# EAGLE design EV-Board-Camera_V1.0 (EAGLE 9.6.2)
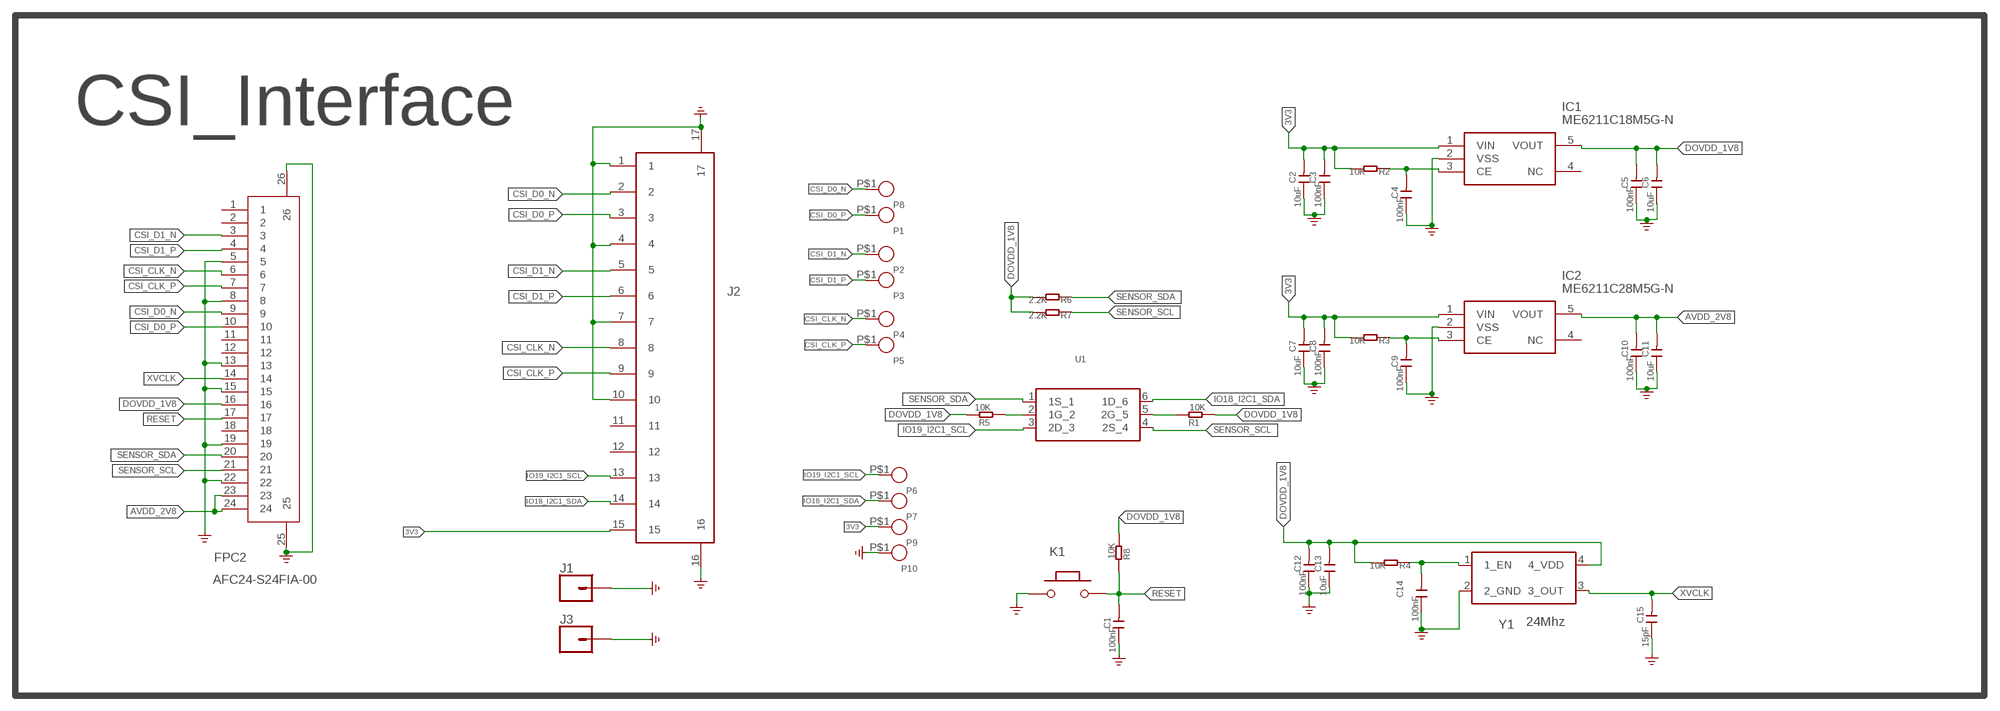
[diagram p0: schematic, sheet 1]

## Parts
C1  100nF  CAPC0402-1  [C0402]
C2  10uF  CAPC0402-1  [C0402]
C3  100nF  CAPC0402-1  [C0402]
C4  100nF  CAPC0402-1  [C0402]
C5  100nF  CAPC0402-1  [C0402]
C6  10uF  CAPC0402-1  [C0402]
C7  10uF  CAPC0402-1  [C0402]
C8  100nF  CAPC0402-1  [C0402]
C9  100nF  CAPC0402-1  [C0402]
C10  100nF  CAPC0402-1  [C0402]
C11  10uF  CAPC0402-1  [C0402]
C12  100nF  CAPC0402-1  [C0402]
C13  10uF  CAPC0402-1  [C0402]
C14  100nF  CAPC0402-1  [C0402]
C15  15pF  CAPC0402-1  [C0402]
FPC2  AFC24-S24FIA-00  [FPC-SMD_P0.50-24P_QCHF-SM-H2.0]
IC1  ME6211C18M5G-N  [SOT95P282X145-5N]
IC2  ME6211C28M5G-N  ME6211C18M5G-N  [SOT95P282X145-5N]
J1  CONN_01_3.1MM_SMD1X01_3.1MM_SMD  [1X01_2MM]
J2  C262349_15P_1MM_下接_AFA07-S15FCC-00  [C262349_15P_1MM_下接_AFA07-S15FCC-00]
J3  CONN_01_3.1MM_SMD1X01_3.1MM_SMD  [1X01_2MM]
K1  BUTTON  PB157  [157SW]
P1  TEST_PADPAD-1.5MM  [TEST_PAD-1.5MM]
P2  TEST_PADPAD-1.5MM  [TEST_PAD-1.5MM]
P3  TEST_PADPAD-1.5MM  [TEST_PAD-1.5MM]
P4  TEST_PADPAD-1.5MM  [TEST_PAD-1.5MM]
P5  TEST_PADPAD-1.5MM  [TEST_PAD-1.5MM]
P6  TEST_PADPAD-1.5MM  [TEST_PAD-1.5MM]
P7  TEST_PADPAD-1.5MM  [TEST_PAD-1.5MM]
P8  TEST_PADPAD-1.5MM  [TEST_PAD-1.5MM]
P9  TEST_PADPAD-1.5MM  [TEST_PAD-1.5MM]
P10  TEST_PADPAD-1.5MM  [TEST_PAD-1.5MM]
R1  10K  RES-0402  [R0402]
R2  10K  RES-0402  [R0402]
R3  10K  RES-0402  [R0402]
R4  10K  RES-0402  [R0402]
R5  10K  RES-0402  [R0402]
R6  2.2K  RES-0402  [R0402]
R7  2.2K  RES-0402  [R0402]
R8  10K  RES-0402  [R0402]
U1  WST2006  [WST2006]
Y1  24Mhz  24MHZ  [24MHZ_1631-24003-BTKEYA]

## Nets
3V3: C2.2 C3.2 C7.2 C8.2 IC1.1(VIN) IC2.1(VIN) J2.15 P9.P$1 R2.2 R3.2
AVDD_2V8: C10.2 C11.2 FPC2.23 FPC2.24 IC2.5(VOUT)
CSI_CLK_N: FPC2.6 J2.8 P4.P$1
CSI_CLK_P: FPC2.7 J2.9 P5.P$1
CSI_D0_N: FPC2.9 J2.2 P8.P$1
CSI_D0_P: FPC2.10 J2.3 P1.P$1
CSI_D1_N: FPC2.3 J2.5 P2.P$1
CSI_D1_P: FPC2.4 J2.6 P3.P$1
DOVDD_1V8: C5.2 C6.2 C12.2 C13.2 FPC2.16 IC1.5(VOUT) R1.1 R4.2 R5.2 R6.2 R7.2 R8.1 Y1.4(4_VDD)
GND: C1.1 C2.1 C3.1 C4.1 C5.1 C6.1 C7.1 C8.1 C9.1 C10.1 C11.1 C12.1 C13.1 C14.1 C15.1 FPC2.5 FPC2.8 FPC2.13 FPC2.15 FPC2.19 FPC2.22 FPC2.25 FPC2.26 IC1.2(VSS) IC2.2(VSS) J1.1 J2.1 J2.4 J2.7 J2.10 J2.16 J2.17 J3.1 K1.1 P10.P$1 Y1.2(2_GND)
IO18_I2C1_SDA: J2.14 P7.P$1 U1.6(1D_6)
IO19_I2C1_SCL: J2.13 P6.P$1 U1.3(2D_3)
N$1: R5.1 U1.2(1G_2)
N$2: C4.2 IC1.3(CE) R2.1
N$4: R1.2 U1.5(2G_5)
N$5: C9.2 IC2.3(CE) R3.1
N$8: C14.2 R4.1 Y1.1(1_EN)
RESET: C1.2 FPC2.17 K1.2 R8.2
SENSOR_SCL: FPC2.21 R7.1 U1.4(2S_4)
SENSOR_SDA: FPC2.20 R6.1 U1.1(1S_1)
XVCLK: C15.2 FPC2.14 Y1.3(3_OUT)
Unconnected: FPC2.1 FPC2.2 FPC2.11 FPC2.12 FPC2.18 IC1.4(NC) IC2.4(NC) J2.11 J2.12

## Notes on the sheet
- CSI_Interface

## Library data of the parts
C1-C15 = SX1302_Module:CAP*
FPC2 = FPC:AFC24-S24FIA-00
IC1 IC2 = ME6211C18M(22M)5G-N:ME6211C18M5G-N: High Speed LDO Regulators, High PSRR, Low noise Source: Datasheet <https://datasheet.lcsc.com/lcsc/1809141122_MICRONE-Nanjing-Micro-One-Elec-ME6211C18M5G-N_C236671.pdf>; DESCRIPTION: High Speed LDO Regulators, High PSRR, Low noise; HEIGHT: 1.45mm; MANUFACTURER_NAME: Micron; MANUFACTURER_PART_NUMBER: ME6211C18M5G-N
J1 J3 = SparkFun-Connectors:CONN_01_3.1MM_SMD: Single connection point. Often used as Generic Header-pin footprint for 0.1 inch spaced/style header connections On any of the 0.1 inch spaced packages, you can populate with these: Break Away Headers - Straight <https://www.sparkfun.com/products/116> (PRT-00116) Break Away Male Headers - Right Angle <https://www.sparkfun.com/products/553> (PRT-00553) Female Headers <https://www.sparkfun.com/products/115> (PRT-00115) Break Away Headers - Machine Pin <https://www.sparkfun.com/products/117> (PRT-00117) Break Away Female Headers - Swiss Machine Pin <https://www.sparkfun.com/products/743> (PRT-00743) This device is also useful as a general connection point to wire up your design to another part of your project. Our various solder wires solder well into these plated through hole pads. Hook-Up Wire - Assortment (Stranded, 22 AWG) <https://www.sparkfun.com/products/11375> (PRT-11375) Hook-Up Wire - Assortment (Solid Core, 22 AWG) <https://www.sparkfun.com/products/11367> (PRT-11367) View the entire wire category on our website here <https://www.sparkfun.com/categories/141> Special notes: SMTSO-256-ET is a "flush mount" nut for a 4-40 screw. We mostly use this on specialty testbeds; it is a nice way to connect hardware to your PCB at an adjustable hieght. Also note, the SNAP packages are for using a snappable style connector. We sell a baggie of snaps and they are also used on two LilyPad designs: Snap Assortment - 30 pack (male and female) <https://www.sparkfun.com/products/11347> (DEV-11347) LilyPad Arduino SimpleSnap <https://www.sparkfun.com/products/10941> (DEV-10941) LilyPad SimpleSnap Protoboard <https://www.sparkfun.com/products/10940> (DEV-10940)
J2 = FPC:C262349_15P_1MM_下接_AFA07-S15FCC-00
K1 = MySMD:PB157
P1-P10 = CrowPanel_Advance_HMI:TEST_PAD*
R1-R8 = SX1302_Module:RES*
U1 = WST2006:WST2006
Y1 = 24MHZ_1631-24003-BTKEYA:24MHZ

## Net classes
0 default: width 0.152 mm, drill 0.3 mm, clearance 0.152 mm

## Board
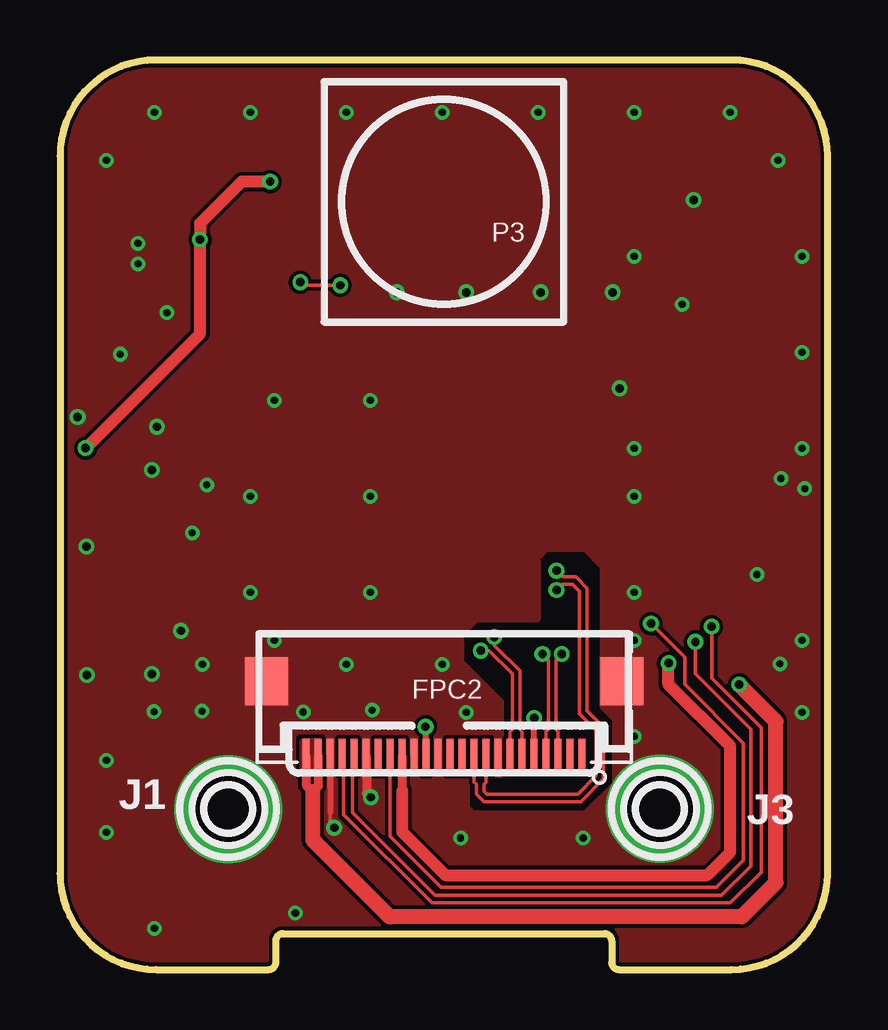
[diagram p1: board, top side]
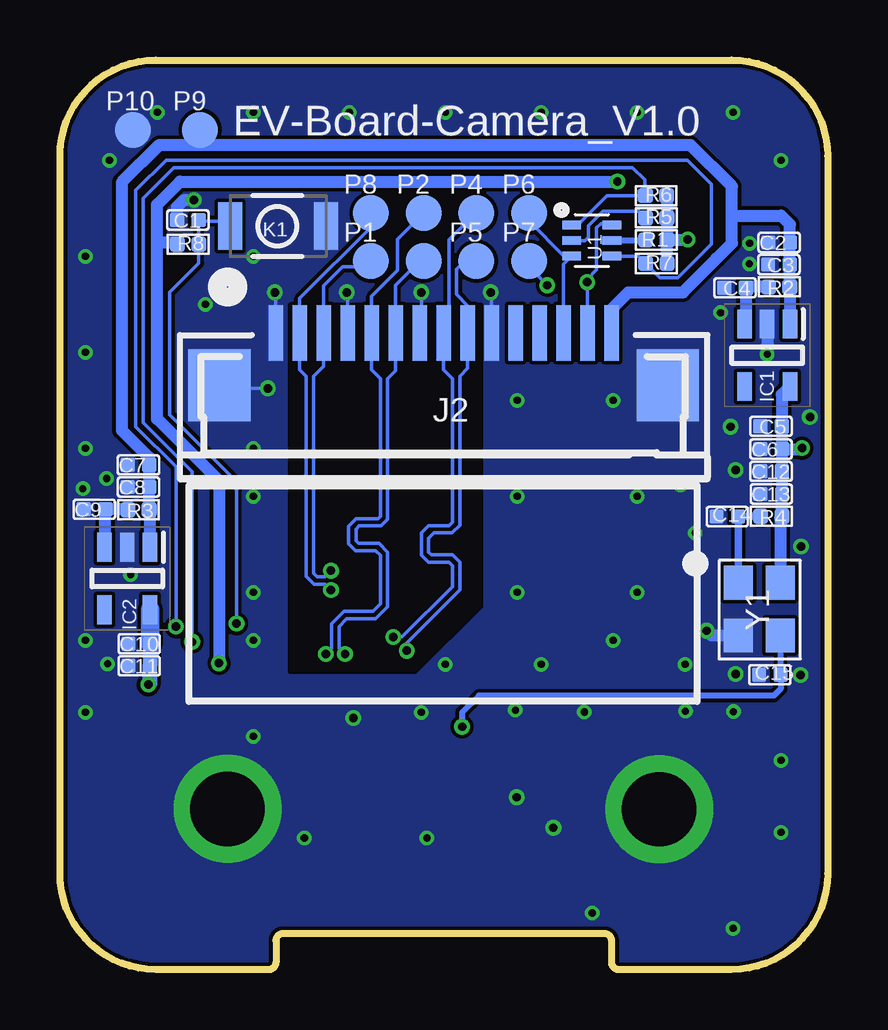
[diagram p2: board, bottom side, seen from below]

Size 32 x 37.9 mm. Coordinates in mm from the lower left corner, seen from the top.
Outline: 0,33.9 0,4 arc90 4,0 8.7,0 arc90 9,0.3 9,1.2 arc-90 9.3,1.5 22.7,1.5 arc-90 23,1.2 23,0.3 arc90 23.3,0 28,0 arc90 32,4 32,33.9 arc90 28,37.9 4,37.9 arc90 0,33.9
Copper layers (1*16): Top 0.035mm / dielectric 1.5mm / Bottom 0.035mm
Design rules "HMI_GZ": minimum track width 6mil, minimum drill 0.3mm, track to track 6mil, track to pad 6mil, pad to pad 6mil, via to via 6mil, smd to smd 6mil, copper to edge 6mil, drill to drill 4mil, minimum pad ring 6mil, minimum via ring 6mil, stop-mask expansion 4mil, vias tented up to drill 100mil, thermal gap 0mil

### Footprints (pad centres in the part's own frame; a part is rotated, then mirrored left to right if it is on the bottom)
C0402 = smd 0.6 x 0.6: 1 -0.45,0; 2 0.45,0
FPC-SMD_P0.50-24P_QCHF-SM-H2.0 = smd 0.3 x 1.5: 1 5.75,-1.574; 2 5.25,-1.574; 3 4.75,-1.574; 4 4.25,-1.574; 5 3.75,-1.574; 6 3.25,-1.574; 7 2.75,-1.574; 8 2.25,-1.574; 9 1.75,-1.574; 10 1.25,-1.574; 11 0.75,-1.574; 12 0.25,-1.574; 13 -0.25,-1.574; 14 -0.75,-1.574; 15 -1.25,-1.574; 16 -1.75,-1.574; 17 -2.25,-1.574; 18 -2.75,-1.574; 19 -3.25,-1.574; 20 -3.75,-1.574; 21 -4.25,-1.574; 22 -4.75,-1.574; 23 -5.25,-1.574; 24 -5.75,-1.574 | smd 1.8 x 2: 25 7.4,1.576; 26 -7.4,1.576
SOT95P282X145-5N = smd 1.2 x 0.6: 1 -1.3,0.95; 2 -1.3,0; 3 -1.3,-0.95; 4 1.3,-0.95; 5 1.3,0.95
1X01_2MM = drill 3.1 pad 4.5: 1 0,0
C262349_15P_1MM_下接_AFA07-S15FCC-00 = smd 0.6 x 2.3: 1 -7,1.084; 2 -6,1.084; 3 -5,1.084; 4 -4,1.084; 5 -3,1.084; 6 -2,1.084; 7 -1,1.084; 8 0,1.084; 9 1,1.084; 10 2,1.084; 11 3,1.084; 12 4,1.084; 13 5,1.084; 14 6,1.084; 15 7,1.084 | smd 2.6 x 3: 16 -9.352,-1.085; 17 9.352,-1.085
157SW = smd 1.016 x 1.981: 1 0,0; 2 4,0
TEST_PAD-1.5MM = smd 1.5 x 1.5: P$1 0,0
R0402 = smd 0.635 x 0.635: 1 -0.445,0; 2 0.445,0
WST2006 = smd 0.35 x 0.78: 1 -0.65,-0.84; 2 0,-0.84; 3 0.65,-0.84; 4 0.65,0.84; 5 0,0.84; 6 -0.65,0.84
24MHZ_1631-24003-BTKEYA = smd 1.4 x 1.2: 1 -1.1,-0.875; 2 1.1,-0.875; 3 1.1,0.875; 4 -1.1,0.875

### Placement (x,y rotation side)
C1  26.67,31.24 0 bottom
C2  2.02,30.3 0 bottom
C3  2.03,29.38 0 bottom
C4  3.86,28.41 0 bottom
C5  2.36,22.64 0 bottom
C6  2.36,21.69 0 bottom
C7  28.73,21.03 0 bottom
C8  28.73,20.11 0 bottom
C9  30.57,19.18 0 bottom
C10  28.7,13.58 0 bottom
C11  28.7,12.66 0 bottom
C12  2.36,20.76 0 bottom
C13  2.35,19.82 0 bottom
C14  4.18,18.88 0 bottom
C15  2.41,12.29 0 bottom
FPC2  16.02,10.44 0 top
IC1  2.52,25.6 270 bottom
IC2  29.2,16.3 270 bottom
J1  7.02,6.68 0 top
J2  16.01,25.44 0 bottom
J3  25.02,6.69 0 top
K1  20.91,30.98 180 bottom
P1  19.04,29.52 0 bottom
P2  16.84,31.52 0 bottom
P3  16.84,29.52 0 bottom
P4  14.64,31.52 0 bottom
P5  14.64,29.52 0 bottom
P6  12.44,31.52 0 bottom
P7  12.44,29.52 0 bottom
P8  19.04,31.52 0 bottom
P9  26.16,34.99 0 bottom
P10  28.96,34.99 0 bottom
R1  7.14,30.4 180 bottom
R2  2.02,28.45 0 bottom
R3  28.73,19.16 0 bottom
R4  2.35,18.89 0 bottom
R5  7.14,31.32 0 bottom
R6  7.15,32.25 0 bottom
R7  7.14,29.42 0 bottom
R8  26.66,30.22 0 bottom
U1  9.83,30.38 270 bottom
Y1  2.85,15.02 270 bottom

### Tracks (layer width: path | path; a pad name or v marks a point on that pad's centre or on a via)
3V3
  Bottom 0.508: IC1.1 R2.2 C3.2 C2.2 1.57,31.05 1.94,31.42 3.84,31.42 3.99,31.27 | J2.15 9.01,27.52 8.31,28.22 6.03,28.22 4.64,29.61 4.64,29.62 3.99,30.27 3.99,31.27 | 3.99,31.27 3.99,32.63 5.71,34.36 26.03,34.36 | 26.03,34.36 27.86,34.36 29.42,32.8 29.42,22.47 28.28,21.33 C7.2 C8.2 R3.2 28.25,19.12 IC2.1 | P9.P$1 26.16,34.48 26.03,34.36
AVDD_2V8  (via drill 0.35)
  Top 0.381: FPC2.23 10.77,7.65 10.54,7.42 10.27,7.69 FPC2.24
  Top 0.635: 10.54,7.42 10.54,5.4 13.74,2.2 28.42,2.2 29.84,3.62 29.84,10.34 v28.31,11.88
  Bottom 0.635: C10.2 C11.2 28.25,11.94 v28.31,11.88
  Bottom 0.762: IC2.5 C10.2
  pour Top (no thermals): 10.02,9.54 10.12,9.64 10.82,9.64 10.92,9.54 10.92,8.14 10.82,8.04 10.12,8.04 10.02,8.14
CSI_CLK_N  (via drill 0.35)
  Top 0.152: FPC2.6 19.27,9.92 19.17,10.02 19.17,12.44 18.11,13.5 v18.11,13.86
  Bottom 0.152: v18.11,13.86 17.74,13.86 15.64,15.96 15.64,16.82 15.79,16.97 16.64,16.97 16.94,17.27 16.94,18.2 16.64,18.5 15.78,18.5 15.64,18.65 15.64,24.62 16.01,24.99 J2.8 15.78,26.75 15.78,30.42 14.68,31.52 P4.P$1
CSI_CLK_P  (via drill 0.35)
  Top 0.152: FPC2.7 18.77,9.92 18.86,10.02 18.86,12.32 17.89,13.29 v17.54,13.29
  Bottom 0.152: v17.54,13.29 17.54,13.63 15.33,15.83 15.33,16.97 15.64,17.28 16.51,17.28 16.63,17.4 16.63,17.97 16.41,18.2 15.65,18.2 15.33,18.52 15.33,24.72 15.01,25.05 J2.9 15.01,27.67 15.47,28.13 15.47,29.19 15.14,29.52 P5.P$1
CSI_D0_N  (via drill 0.35)
  Top 0.152: FPC2.9 17.77,7.81 17.67,7.71 17.67,7.43 17.8,7.31 21.59,7.31 22.35,8.07 22.35,9.97 21.67,10.66 21.67,15.76 21.37,16.06 20.94,16.06 v20.7,15.82
  Bottom 0.152: v20.7,15.82 20.94,16.06 21.4,16.06 21.74,16.39 21.74,24.72 22.01,24.99 J2.2 22.01,27.97 19.04,30.94 P8.P$1
CSI_D0_P  (via drill 0.35)
  Top 0.152: FPC2.10 17.27,7.81 17.36,7.71 17.36,7.31 17.67,7 21.72,7 22.66,7.94 22.66,10.1 21.97,10.79 21.97,15.9 21.51,16.36 20.96,16.36 v20.7,16.62
  Bottom 0.152: v20.7,16.62 20.95,16.37 21.28,16.37 21.43,16.52 21.43,24.72 21.01,25.15 J2.3 21.01,28.5 20.22,29.28 19.4,29.28 P1.P$1
CSI_D1_N  (via drill 0.35)
  Top 0.152: FPC2.3 20.77,9.92 20.67,10.02 20.67,12.9 v20.92,13.15
  Bottom 0.152: 20.15,14.94 18.95,14.94 18.64,15.25 18.64,17.26 18.84,17.46 19.67,17.46 19.96,17.75 19.96,18.48 19.66,18.79 18.75,18.79 18.64,18.89 18.64,24.62 19.01,24.99 J2.5 19.01,28.05 17.93,29.13 17.93,30.43 P2.P$1 | 20.15,14.94 | v20.92,13.15 20.67,13.4 20.67,14.42 20.15,14.94
CSI_D1_P  (via drill 0.35)
  Top 0.152: FPC2.4 20.27,9.92 20.36,10.02 20.36,12.9 v20.11,13.15
  Bottom 0.152: v20.11,13.15 20.36,13.4 20.36,14.29 20.05,14.61 18.85,14.61 18.34,15.12 18.34,17.4 18.7,17.76 19.55,17.76 19.66,17.87 19.66,18.35 19.52,18.48 18.61,18.48 18.34,18.76 18.34,24.62 18.01,24.95 J2.6 18.01,28.52 17,29.52 P3.P$1
DOVDD_1V8  (via drill 0.35)
  Top 0.381: FPC2.16 14.27,7.45
  Top 0.508: v1.07,21.73 5.84,26.5 v5.84,30.42 5.84,31.09 7.58,32.83 v8.76,32.83 | 14.27,7.45 14.27,5.74 16.07,3.94 26.99,3.94 27.94,4.89 27.94,9.31 25.37,11.88 v25.37,12.77
  Bottom 0.508: C6.2 C5.2 1.91,23.96 IC1.5 | 1.9,19.85 C13.2 | 1.9,19.85 R4.2 1.97,18.82 Y1.4 | 1.9,19.85 1.91,19.85 C12.2 C6.2 | R1.1 5.86,30.4 v5.84,30.42 | R7.2 R1.1 | v25.37,12.77 25.37,20.37 27.95,22.95 27.95,30.29 | 27.95,30.29 27.95,31.88 26.99,32.83 v8.76,32.83 | C6.2 1.11,21.69 v1.07,21.73 | R1.1 R5.2 R6.2 | R8.1 27.17,30.29 27.95,30.29
GND  (via drill 0.3, 0.35)
  Top 0.152: 11.27,6.56 11.27,6.07 v11.43,5.91
  Top 0.254: FPC2.22 11.27,6.56 | FPC2.5 v19.77,10.47 v19.78,10.48
  Top 0.381: FPC2.19 12.77,7.34 12.93,7.18 v12.95,7.18
  Bottom 0.152: J2.10 14.01,28.19 v14.04,28.22 | J2.7 16.94,26.59 v16.94,28.22 | J2.4 20.01,28.19 v20.04,28.22 | J2.1 23.01,28.19 v23.04,28.22 | J2.16 25.22,24.22 v23.34,24.22
  Bottom 0.508: IC1.2 v2.52,25.64 | Y1.2 4.84,13.92 v5.04,14.12 | C1.1 27.12,31.76 27.13,31.77 26.82,32.07 v26.42,32.07
  other vias: 6.12,20.2 5.52,18.2 30.02,12.74 0.74,23.02 4.04,22.62 3.84,20.82 3.84,12.32 12.94,19.72 12.94,23.72 23.94,19.72 23.94,21.72 23.94,15.72 23.94,13.72 23.94,9.72 7.94,19.72 7.94,15.72 12.94,15.72 8.94,23.72 9.81,2.35 3.94,1.72 1.94,5.72 1.94,8.72 5.94,12.72 15.94,12.72 16.94,10.72 11.94,12.72 8.94,13.72 16.7,5.48 21.81,5.48 3.25,30.26 3.26,29.41 4.46,27.37 1.94,33.72 3.94,35.72 7.94,35.72 11.94,35.72 15.94,35.72 19.94,35.72 23.94,35.72 27.94,35.72 29.94,33.72 23.94,29.72 25.94,27.72 30.94,29.72 30.94,25.72 30.94,21.72 31.05,20.04 30.06,20.46 29.06,16.46 30.94,13.72 30.94,10.72 1.13,12.27 1.11,17.63 3.93,10.75 5.93,10.77 10.14,10.73 13.02,10.81
  pour Top (rank 2, no thermals): -1.98,33.44 2.52,37.94 30.92,37.94 34.02,34.84 34.02,2.14 30.82,-1.06 1.42,-1.06 -1.98,2.34
  pour Bottom (rank 2, no thermals): -1.98,33.44 2.52,37.94 30.92,37.94 34.02,34.84 34.02,2.14 30.82,-1.06 1.42,-1.06 -1.98,2.34
  cutout Bottom: 14.44,27.72 14.44,15.12 17.17,12.38 22.44,12.38 22.44,27.72
  cutout Top: 17.5,6.67 21.84,6.67 22.99,7.81 22.99,10.35 22.48,10.86 22.48,16.7 21.84,17.34 20.32,17.34 20.07,17.09 20.07,14.55 19.94,14.42 17.4,14.42 16.89,13.91 16.89,12.89 18.54,11.24 18.54,8.07 18.41,7.94 18.16,7.94 18.03,8.07 18.03,9.72
  cutout Top: 17.53,6.67 17.27,6.67 17.14,6.8 17.14,9.59 17.27,9.72 17.78,9.72 18.03,9.72 18.03,6.93 18.03,6.67
IO18_I2C1_SDA  (via drill 0.35)
  Top 0.152: v10.02,28.64 10.14,28.52 v11.68,28.52
  Bottom 0.152: U1.6 9.04,31.08 9.45,31.08 9.63,30.91 9.63,29.15 10.02,28.76 v10.02,28.64 10.02,26.53 J2.14 | v11.68,28.52 12.44,29.27 P7.P$1
IO19_I2C1_SCL
  Bottom 0.152: J2.13 11.01,29.39 U1.3 10.99,29.73 12.44,31.17 P6.P$1
N$1
  Bottom 0.152: R5.1 7.86,31.59 9.37,31.59 9.97,31 9.97,30.51 10.11,30.37 U1.2
N$2
  Bottom 0.508: R2.1 3.37,28.45 C4.2 3.41,26.96 IC1.3
N$4
  Bottom 0.152: 7.74,30.38 7.6,30.38 R1.2
  Bottom 0.254: U1.5 7.74,30.38
N$5
  Bottom 0.508: IC2.3 30.12,17.63 C9.2 29.19,19.18 R3.1
N$8
  Bottom 0.305: Y1.1 C14.2 R4.1
RESET  (via drill 0.35)
  Top 0.152: FPC2.17 13.77,5.56 15.89,3.43 27.36,3.43 28.5,4.56 28.5,9.44 26.05,11.88 26.05,13.01 24.65,14.42 v24.64,14.42
  Bottom 0.152: v24.64,14.42 24.64,20.33 27.44,23.13 27.44,28.22 26.22,29.44 R8.2 26.21,31.18 | 26.21,31.18 C1.2 | K1.2 25.11,31.18 26.21,31.18
SENSOR_SCL  (via drill 0.35)
  Top 0.152: FPC2.21 11.83,8.81 11.83,6.45 15.5,2.78 27.95,2.78 29.23,4.06 29.23,10.07 27.17,12.14 v27.17,14.29 v27.16,14.29
  Bottom 0.152: U1.4 7.89,29.73 R7.1 6.98,28.82 6.24,28.82 4.84,30.22 4.84,32.72 5.84,33.72 27.58,33.72 28.84,32.47 28.84,22.62 27.16,20.95 v27.16,14.29
SENSOR_SDA  (via drill 0.35)
  Top 0.152: FPC2.20 12.2,8.8 12.2,6.54 15.64,3.09 27.58,3.09 28.8,4.31 28.8,10.02 26.49,12.34 v26.49,13.66
  Bottom 0.152: v26.49,13.66 26.49,20.74 28.53,22.79 28.53,32.14 27.26,33.42 8.13,33.42 7.62,32.91 7.62,32.25 | R6.1 7.62,32.25 | 7.62,32.25 9.2,32.25 10.42,31.03 U1.1
XVCLK  (via drill 0.35)
  Top 0.254: v15.24,10.12 15.24,8.9 FPC2.14
  Bottom 0.254: Y1.3 1.97,12.3 C15.2 1.96,11.7 2.24,11.42 14.54,11.42 15.24,10.72 v15.24,10.12

### Text on the board
bPlace: EV-Board-Camera_V1.0